# Altium schematic sheet [03] MainBoard.SchDoc
size A3
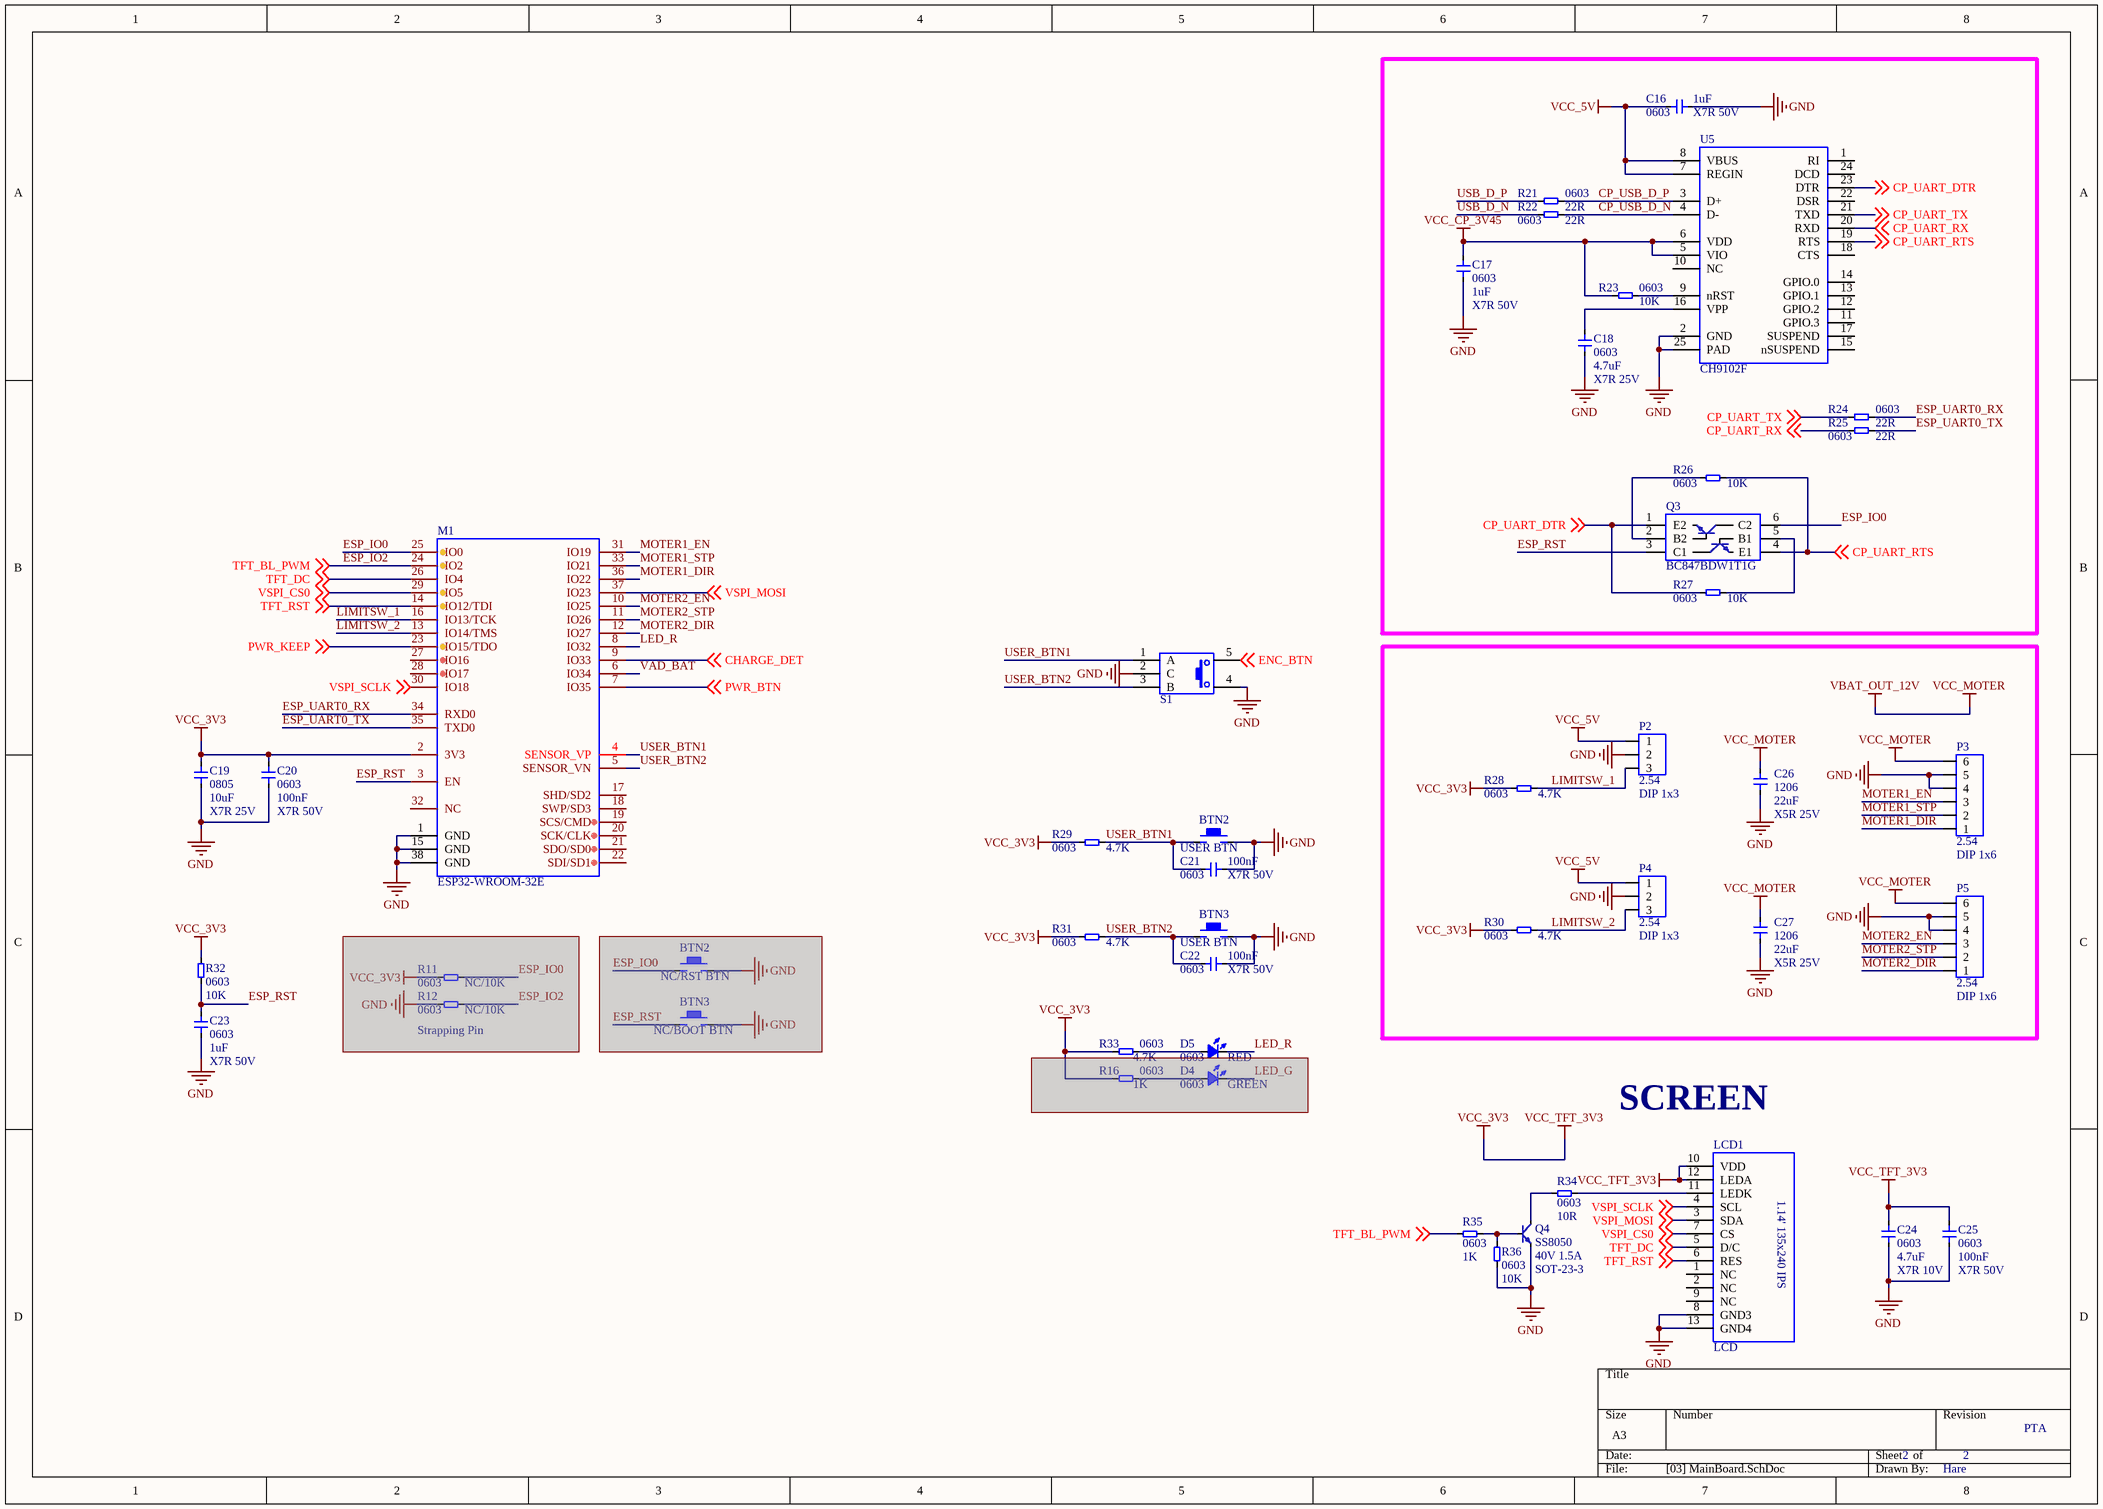
[diagram p0: [03] MainBoard.SchDoc]

## Parts
(Parts that share a designator on the sheet are numbered #1, #2 ... from top to bottom, then left to right.)
BTN2#1  USER BTN  [BTN-4P-4.2*3.4*2.5]
BTN2#2  NC/RST BTN  [BTN-4P-3.0*6.0*3.5]  (masked out: inside a compile mask, not in the netlist)
BTN3#1  USER BTN  [BTN-4P-4.2*3.4*2.5]
BTN3#2  NC/BOOT BTN  [BTN-4P-3.0*6.0*3.5]  (masked out: inside a compile mask, not in the netlist)
C16  Footprint: 0603  Specification: X7R 50V  [CAP_0603]  (hidden comment: 1uF)
C17  Footprint: 0603  Specification: X7R 50V  [CAP_0603]  (hidden comment: 1uF)
C18  Footprint: 0603  Specification: X7R 25V  [CAP_0603]  (hidden comment: 4.7uF)
C19  Footprint: 0805  Specification: X7R 25V  [CAP_0805]  (hidden comment: 10uF)
C20  Footprint: 0603  Specification: X7R 50V  [CAP_0603]  (hidden comment: 100nF)
C21  Footprint: 0603  Specification: X7R 50V  [CAP_0603]  (hidden comment: 100nF)
C22  Footprint: 0603  Specification: X7R 50V  [CAP_0603]  (hidden comment: 100nF)
C23  Footprint: 0603  Specification: X7R 50V  [CAP_0603]  (hidden comment: 1uF)
C24  Footprint: 0603  Specification: X7R 10V  [CAP_0603]  (hidden comment: 4.7uF)
C25  Footprint: 0603  Specification: X7R 50V  [CAP_0603]  (hidden comment: 100nF)
C26  Footprint: 1206  Specification: X5R 25V  [CAP_1206]  (hidden comment: 22uF)
C27  Footprint: 1206  Specification: X5R 25V  [CAP_1206]  (hidden comment: 22uF)
D4  Footprint: 0603  [LED_DIP_3MM]  (hidden comment: GREEN)  (masked out: inside a compile mask, not in the netlist)
D5  Footprint: 0603  [LED_0603]  (hidden comment: RED)
LCD1  LCD  [LCD-IPS-1.14-135x240-TOP]
M1  ESP32-WROOM-32E  [ESP-32]
P2  Type: 2.54  [XH_3-sleep]  (hidden comment: DIP 1x3)
P3  Type: 2.54  [XH_6-sleep]  (hidden comment: DIP 1x6)
P4  Type: 2.54  [XH_3-sleep]  (hidden comment: DIP 1x3)
P5  Type: 2.54  [XH_6-sleep]  (hidden comment: DIP 1x6)
Q3  BC847BDW1T1G  [SC70-6]
Q4  Specification: 40V 1.5A  [SOT-23-3]  (hidden comment: SS8050)
R11  Footprint: 0603  [RES_0603]  (hidden comment: NC/10K)  (masked out: inside a compile mask, not in the netlist)
R12  Footprint: 0603  [RES_0603]  (hidden comment: NC/10K)  (masked out: inside a compile mask, not in the netlist)
R16  Footprint: 0603  [RES_0603]  (hidden comment: 1K)  (masked out: inside a compile mask, not in the netlist)
R21  Footprint: 0603  [RES_0603]  (hidden comment: 22R)
R22  Footprint: 0603  [RES_0603]  (hidden comment: 22R)
R23  Footprint: 0603  [RES_0603]  (hidden comment: 10K)
R24  Footprint: 0603  [RES_0603]  (hidden comment: 22R)
R25  Footprint: 0603  [RES_0603]  (hidden comment: 22R)
R26  Footprint: 0603  [RES_0603]  (hidden comment: 10K)
R27  Footprint: 0603  [RES_0603]  (hidden comment: 10K)
R28  Footprint: 0603  [RES_0603]  (hidden comment: 4.7K)
R29  Footprint: 0603  [RES_0603]  (hidden comment: 4.7K)
R30  Footprint: 0603  [RES_0603]  (hidden comment: 4.7K)
R31  Footprint: 0603  [RES_0603]  (hidden comment: 4.7K)
R32  Footprint: 0603  [RES_0603]  (hidden comment: 10K)
R33  Footprint: 0603  [RES_0603]  (hidden comment: 4.7K)
R34  Footprint: 0603  [RES_0603]  (hidden comment: 10R)
R35  Footprint: 0603  [RES_0603]  (hidden comment: 1K)
R36  Footprint: 0603  [RES_0603]  (hidden comment: 10K)
S1  RotaryEncoder  [RotaryEncoder]  (value not drawn)
U5  CH9102F  [QFN-24-4.0X4.0-P0.5]

## Nets
GND: BTN2#1.2 BTN3#1.2 C16.1 C17.2 C18.2 C19.1 C20.1 C21.1 C22.1 C23.1 C24.1 C25.2 C26.1 C27.1 LCD1.8(GND3) LCD1.13(GND4) M1.1(GND) M1.15(GND) M1.38(GND) P2.2 P3.4 P3.5 P4.2 P5.4 P5.5 Q4.2(E) R36.1 S1.2(C) S1.4 U5.2(GND) U5.25(PAD)
VBAT_OUT_12V: C26.2 C27.2 P3.6 P5.6  [also labelled VCC_MOTER]
VCC_3V3: C19.2 C20.2 C24.2 C25.1 LCD1.10(VDD) LCD1.12(LEDA) M1.2(3V3) R28.1 R29.1 R30.1 R31.1 R32.2 R33.1  [also labelled VCC_TFT_3V3]
VCC_5V: C16.2 P2.1 P4.1 U5.7(REGIN) U5.8(VBUS)
VCC_CP_3V45: C17.1 R23.1 U5.5(VIO) U5.6(VDD)
CHARGE_DET: M1.9(IO33) ; off-sheet CHARGE_DET
CP_UART_DTR: Q3.1(E2) R27.1 U5.23(DTR) ; off-sheet CP_UART_DTR
CP_UART_RTS: Q3.4(E1) R26.2 U5.19(RTS) ; off-sheet CP_UART_RTS
CP_UART_RX: R25.2 U5.20(RXD) ; off-sheet CP_UART_RX
CP_UART_TX: R24.2 U5.21(TXD) ; off-sheet CP_UART_TX
CP_USB_D_N: R22.1 U5.4(D-)
CP_USB_D_P: R21.1 U5.3(D+)
ENC_BTN: S1.5 ; off-sheet ENC_BTN
ESP_IO0: M1.25(IO0) Q3.6(C2)
ESP_IO2: M1.24(IO2) R35.2 ; off-sheet TFT_BL_PWM  [also labelled TFT_BL_PWM]
ESP_RST: C23.2 M1.3(EN) Q3.3(C1) R32.1
ESP_UART0_RX: M1.34(RXD0) R24.1
ESP_UART0_TX: M1.35(TXD0) R25.1
LED_R: D5.2(K) M1.8(IO32)
LIMITSW_1: M1.16(IO13/TCK) P2.3 R28.2
LIMITSW_2: M1.13(IO14/TMS) P4.3 R30.2
MOTER1_DIR: M1.36(IO22) P3.1
MOTER1_EN: M1.31(IO19) P3.3
MOTER1_STP: M1.33(IO21) P3.2
MOTER2_DIR: M1.12(IO27) P5.1
MOTER2_EN: M1.10(IO25) P5.3
MOTER2_STP: M1.11(IO26) P5.2
PWR_BTN: M1.7(IO35) ; off-sheet PWR_BTN
PWR_KEEP: M1.23(IO15/TDO) ; off-sheet PWR_KEEP
TFT_DC: LCD1.5(D/C) M1.26(IO4) ; off-sheet TFT_DC
TFT_RST: LCD1.6(RES) M1.14(IO12/TDI) ; off-sheet TFT_RST
USB_D_N: R22.2
USB_D_P: R21.2
USER_BTN1: BTN2#1.1 C21.2 M1.4(SENSOR_VP) R29.2 S1.1(A)
USER_BTN2: BTN3#1.1 C22.2 M1.5(SENSOR_VN) R31.2 S1.3(B)
VAD_BAT: M1.6(IO34)
VSPI_CS0: LCD1.7(CS) M1.29(IO5) ; off-sheet VSPI_CS0
VSPI_MOSI: LCD1.3(SDA) M1.37(IO23) ; off-sheet VSPI_MOSI
VSPI_SCLK: LCD1.4(SCL) M1.30(IO18) ; off-sheet VSPI_SCLK
NetC18_1: C18.1 U5.16(VPP)
NetD5_1: D5.1(A) R33.2
NetLCD1_11: LCD1.11(LEDK) R34.2
NetQ3_2: Q3.2(B2) R26.1
NetQ3_5: Q3.5(B1) R27.2
NetQ4_1: Q4.1(B) R35.1 R36.2
NetQ4_3: Q4.3(C) R34.1
NetR23_2: R23.2 U5.9(nRST)

Not connected (* = marked no-connect by the designer): LCD1 1(NC) 2(NC) 9(NC); M1 17(SHD/SD2) 18(SWP/SD3) 19(SCS/CMD) 20(SCK/CLK) 21(SDO/SD0) 22(SDI/SD1) 27(IO16) 28(IO17) 32(NC); U5 1(RI) 10(NC) 11(GPIO.3) 12(GPIO.2) 13(GPIO.1) 14(GPIO.0) 15(nSUSPEND) 17(SUSPEND) 18(CTS) 22(DSR) 24(DCD)

## Notes on the sheet
- (near R12) Strapping Pin
- (near LCD1) SCREEN
- 2
- PTA
- Hare
- Title
- Size:
- Date:
- A4
- Number:
- Time:
- Revision:
- Sheet
- of
- File:
- (in symbol LCD_IPS_1.14_135x240) 1.14' 135x240 IPS

## Library data of the parts
BTN2#1 BTN2#2 BTN3#1 BTN3#2 = Button
C16-C27 = CAP: Capacitor; Manufacturer: *
  C16 C17 C23: Value: 1uF
  C18 C24: Value: 4.7uF
  C19: Value: 10uF
  C20-C22 C25: Value: 100nF
  C26 C27: Value: 22uF
D4 D5 = LED
  D4: Value: GREEN
  D5: Value: RED
LCD1 = LCD_IPS_1.14_135x240
M1 = ESP32-WROOM-32
P2 P4 = HDR1x3: Header; Value: DIP 1x3
P3 P5 = HDR1x6: Header; Value: DIP 1x6
Q3 = Dual_NPN: Dual NPN Transistor
Q4 = BJT_NPN: Transistor; Value: SS8050
R11 R12 R16 R21-R36 = RES: Resistor; Specification: ±1%; Manufacturer: *
  R11 R12: Value: NC/10K
  R16 R35: Value: 1K
  R21 R22 R24 R25: Value: 22R
  R23 R26 R27 R32 R36: Value: 10K
  R28-R31 R33: Value: 4.7K
  R34: Value: 10R
S1 = RotaryEncoder: Encoder; Value: RotaryEncoder
U5 = CP2104: SINGLE-CHIP USB-TO-UART BRIDGE